# Altium schematic sheet DATN2022.MCU.SchDoc
size A
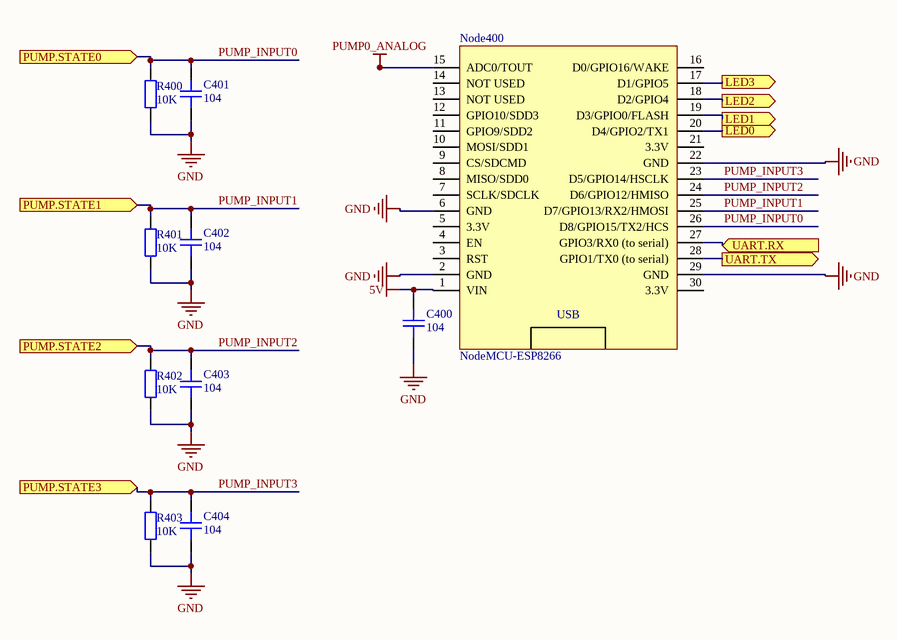
[diagram p0: DATN2022.MCU.SchDoc]

## Parts
C400  104  [CAP_CERAMIC_0805(2012mm)]
C401  104  [CAP_CERAMIC_0805(2012mm)]
C402  104  [CAP_CERAMIC_0805(2012mm)]
C403  104  [CAP_CERAMIC_0805(2012mm)]
C404  104  [CAP_CERAMIC_0805(2012mm)]
Node400  NodeMCU-ESP8266  [NodeMCU_ESP8266]
R400  10K  [RES_0805(2012)]
R401  10K  [RES_0805(2012)]
R402  10K  [RES_0805(2012)]
R403  10K  [RES_0805(2012)]

## Ports
LED0 (out), LED1 (out), LED2 (out), LED3 (out), PUMP.STATE0 (in), PUMP.STATE1 (in), PUMP.STATE2 (in), PUMP.STATE3 (in), UART.RX (in), UART.TX (out)

## Nets
5V: C400.2 Node400.1(VIN)
GND: C400.1 C401.1 C402.1 C403.1 C404.1 Node400.2(GND) Node400.6(GND) Node400.22(GND) Node400.29(GND) R400.1 R401.1 R402.1 R403.1
PUMP0_ANALOG: Node400.15(ADC0/TOUT)
LED0: Node400.20(D4/GPIO2/TX1) ; port LED0
LED1: Node400.19(D3/GPIO0/FLASH) ; port LED1
LED2: Node400.18(D2/GPIO4) ; port LED2
LED3: Node400.17(D1/GPIO5) ; port LED3
PUMP_INPUT0: C401.2 Node400.26(D8/GPIO15/TX2/HCS) R400.2 ; port PUMP.STATE0
PUMP_INPUT1: C402.2 Node400.25(D7/GPIO13/RX2/HMOSI) R401.2 ; port PUMP.STATE1
PUMP_INPUT2: C403.2 Node400.24(D6/GPIO12/HMISO) R402.2 ; port PUMP.STATE2
PUMP_INPUT3: C404.2 Node400.23(D5/GPIO14/HSCLK) R403.2 ; port PUMP.STATE3
UART.RX: Node400.27(GPIO3/RX0_(to_serial)) ; port UART.RX
UART.TX: Node400.28(GPIO1/TX0_(to_serial)) ; port UART.TX

Not connected (* = marked no-connect by the designer): Node400 3(RST) 4(EN) 5(3.3V) 7(SCLK/SDCLK) 8(MISO/SDD0) 9(CS/SDCMD) 10(MOSI/SDD1) 11(GPIO9/SDD2) 12(GPIO10/SDD3) 13(NOT_USED) 14(NOT_USED) 16(D0/GPIO16/WAKE) 21(3.3V) 30(3.3V)

## Notes on the sheet
- (in symbol NodeMCU_ESP8266) USB

## Library data of the parts
C400-C404 = Cap Cer 0805 (2012): Capacitor Ceramic SMD 0805(2012); Value: 33p; Type: Tụ Ceramic; Published: 8-Jun-2000; LatestRevisionDate: 17-Jul-2002; LatestRevisionNote: Re-released for DXP Platform.; PackageReference: RAD-0.3; Publisher: Altium Limited; Component Type: Tụ Ceramic
Node400 = NodeMCU_ESP8266
R400-R403 = R0805: Resistor SMD 0805; Value: 0805; Published: 8-Jun-2000; LatestRevisionDate: 17-Jul-2002; LatestRevisionNote: Re-released for DXP Platform.; PackageReference: AXIAL-0.4; Publisher: Altium Limited